# EAGLE design sidmax (EAGLE 6.6.0)

## Sheet 1 of 7: IO
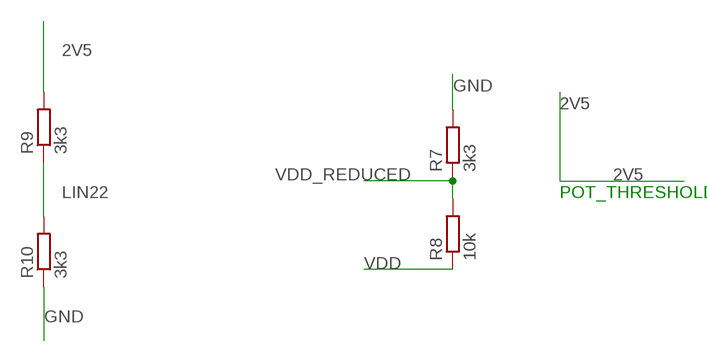
[diagram p0: schematic, sheet 1]

### Parts
R7  3k3  R-EU_R0402  [R0402]
R8  10k  R-EU_R0402  [R0402]
R9  3k3  R-EU_R0402  [R0402]
R10  3k3  R-EU_R0402  [R0402]

### Nets
2V5: R9.2 ; also sheet 2,6
GND: R7.2 R10.1 ; also sheet 2,3,4,5,6,7
LIN22: R9.1 R10.2 ; also sheet 2,3
VDD: R8.1 ; also sheet 3
VDD_REDUCED: R7.1 R8.2 ; also sheet 2

### Notes on the sheet
- POT_THRESHOLD

## Sheet 2 of 7: FPGA
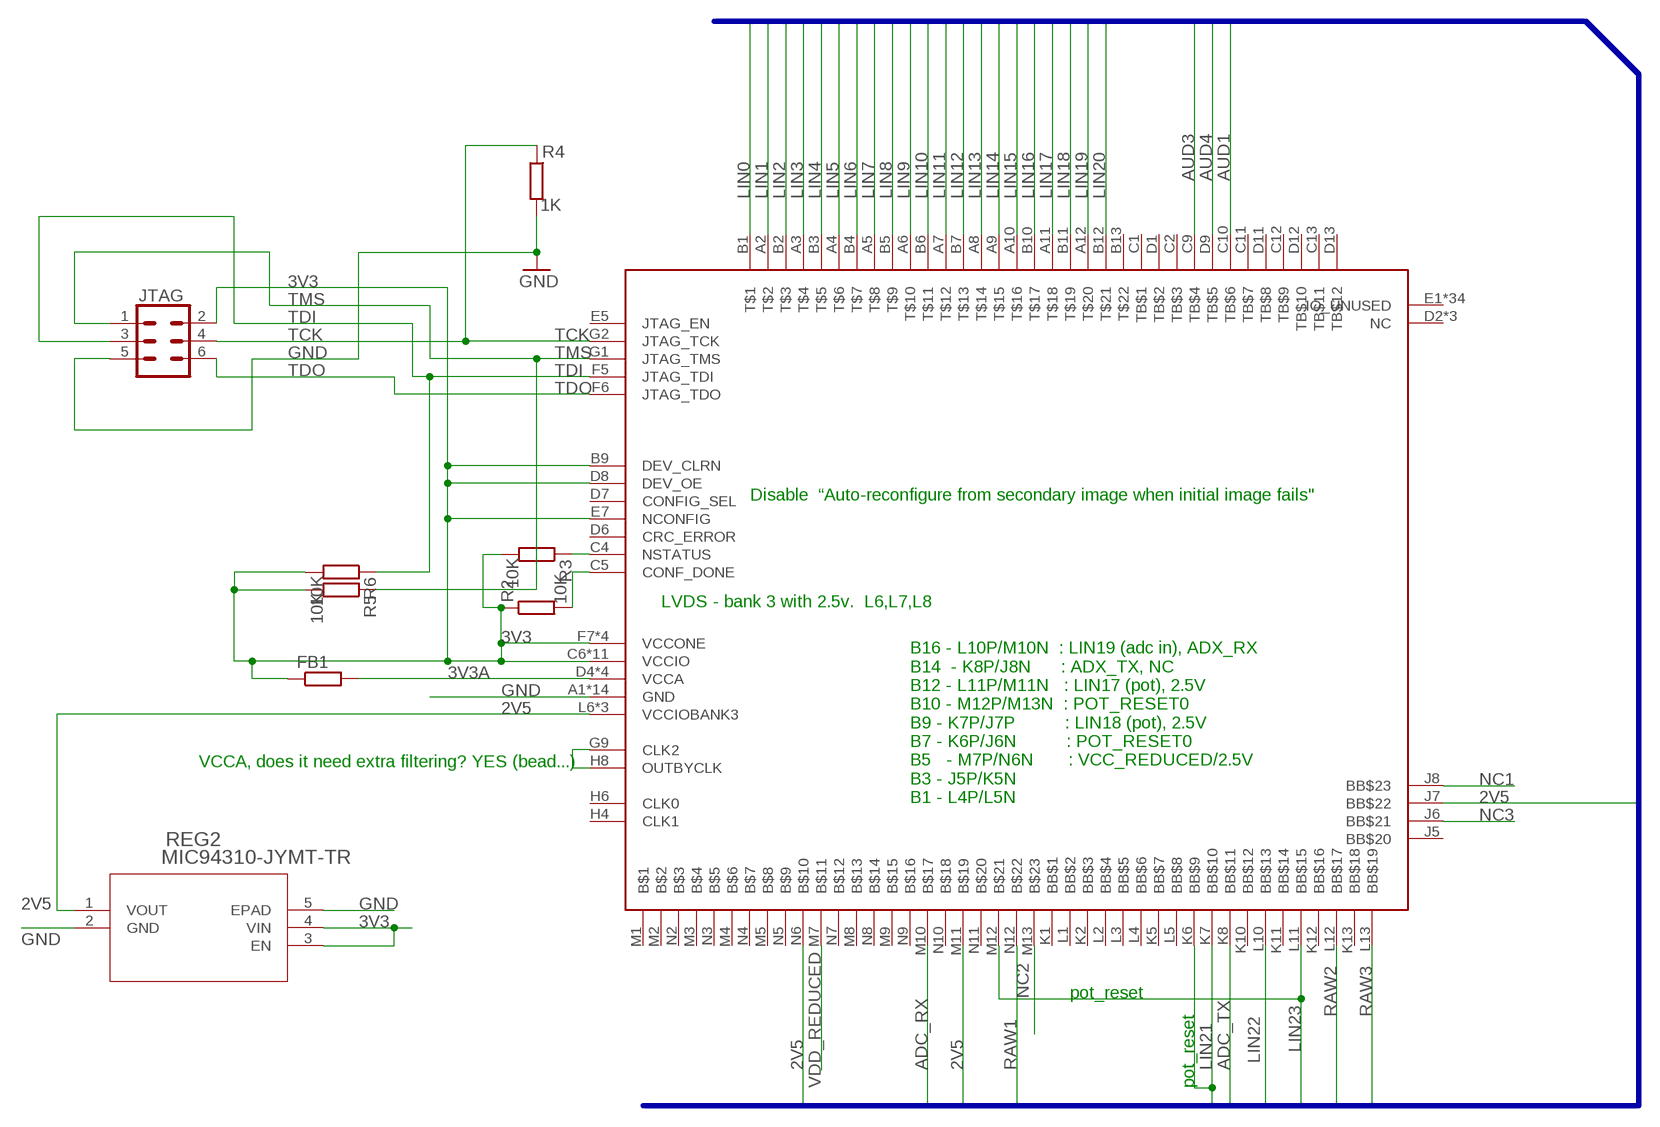
[diagram p1: schematic, sheet 2]

### Parts
FB1  R-EU_R0402  [R0402]
JTAG  CONN_03X2LOCK  [2X3_LOCK]
R2  10K  R-EU_R0402  [R0402]
R3  10K  R-EU_R0402  [R0402]
R4  1K  R-EU_R0402  [R0402]
R5  10K  R-EU_R0402  [R0402]
R6  10K  R-EU_R0402  [R0402]
REG2  MIC94310-JYMT-TR  [TDFN4_1P2X1P6_MCH]
U3  MAX10  [U169SMALL]

### Nets
2V5: REG2.1(VOUT) U3.J7(BB$22) U3.L6(VCCIOBANK3) U3.L7(VCCIOBANK3) U3.L8(VCCIOBANK3) U3.M11(B$19) U3.N6(B$10) ; also sheet 1,6
3V3: FB1.1 JTAG.2 R2.1 R3.2 R5.2 R6.2 REG2.3(EN) REG2.4(VIN) U3.B9(DEV_CLRN) U3.C6(VCCIO) U3.C7(VCCIO) U3.C8(VCCIO) U3.D8(DEV_OE) U3.E7(NCONFIG) U3.F2(VCCIO) U3.F7(VCCONE) U3.F11(VCCIO) U3.G3(VCCIO) U3.G6(VCCONE) U3.G8(VCCONE) U3.G11(VCCIO) U3.H7(VCCONE) U3.H11(VCCIO) U3.J3(VCCIO) U3.J11(VCCIO) U3.K3(VCCIO) ; also sheet 3,4,6
3V3A: FB1.2 U3.D4(VCCA) U3.D10(VCCA) U3.K4(VCCA) U3.K9(VCCA) ; also sheet 6
ADC_RX: U3.M10(B$17) ; also sheet 7
ADC_TX: U3.K8(BB$11) ; also sheet 7
AUD1: U3.C10(TB$6) ; also sheet 5
AUD3: U3.C9(TB$4) ; also sheet 5
AUD4: U3.D9(TB$5) ; also sheet 5
CONF_DONE: R2.2 U3.C5(CONF_DONE)
FAKE_CLK: U3.G9(CLK2) U3.H8(OUTBYCLK)
GND: JTAG.5 R4.2 REG2.2(GND) REG2.5(EPAD) U3.A1(GND) U3.A13(GND) U3.B8(GND) U3.C3(GND) U3.D5(GND) U3.E11(GND) U3.F3(GND) U3.G7(GND) U3.H12(GND) U3.J4(GND) U3.L9(GND) U3.M6(GND) U3.N1(GND) U3.N13(GND) ; also sheet 1,3,4,5,6,7
LIN0: U3.B1(T$1) ; also sheet 3
LIN1: U3.A2(T$2) ; also sheet 3
LIN2: U3.B2(T$3) ; also sheet 3
LIN3: U3.A3(T$4) ; also sheet 3
LIN4: U3.B3(T$5) ; also sheet 3
LIN5: U3.A4(T$6) ; also sheet 3
LIN6: U3.B4(T$7) ; also sheet 3
LIN7: U3.A5(T$8) ; also sheet 3
LIN8: U3.B5(T$9) ; also sheet 3
LIN9: U3.A6(T$10) ; also sheet 3
LIN10: U3.B6(T$11) ; also sheet 3
LIN11: U3.A7(T$12) ; also sheet 3
LIN12: U3.B7(T$13) ; also sheet 3
LIN13: U3.A8(T$14) ; also sheet 3
LIN14: U3.A9(T$15) ; also sheet 3
LIN15: U3.A10(T$16) ; also sheet 3
LIN16: U3.B10(T$17) ; also sheet 3
LIN17: U3.A11(T$18) ; also sheet 3
LIN18: U3.B11(T$19) ; also sheet 3
LIN19: U3.A12(T$20) ; also sheet 3
LIN20: U3.B12(T$21) ; also sheet 3
LIN21: U3.K6(BB$9) U3.K7(BB$10) ; also sheet 3
LIN22: U3.L10(BB$13) ; also sheet 1,3
LIN23: U3.L11(BB$15) U3.M12(B$21) ; also sheet 3
NC1: U3.J8(BB$23)
NC2: U3.M13(B$23)
NC3: U3.J6(BB$21)
NSTATUS: R3.1 U3.C4(NSTATUS)
RAW1: U3.N12(B$22) ; also sheet 3
RAW2: U3.L12(BB$17) ; also sheet 3
RAW3: U3.L13(BB$19) ; also sheet 3
TCK: JTAG.4 R4.1 U3.G2(JTAG_TCK)
TDI: JTAG.3 R6.1 U3.F5(JTAG_TDI)
TDO: JTAG.6 U3.F6(JTAG_TDO)
TMS: JTAG.1 R5.1 U3.G1(JTAG_TMS)
VDD_REDUCED: U3.M7(B$11) ; also sheet 1
Unconnected: U3.B13(T$22) U3.C1(TB$1) U3.C2(TB$3) U3.C11(TB$7) U3.C12(TB$9) U3.C13(TB$11) U3.D1(TB$2) U3.D2(NC) U3.D3(NC) U3.D6(CRC_ERROR) U3.D7(CONFIG_SEL) U3.D11(TB$8) U3.D12(TB$10) U3.D13(TB$12) U3.E1(IO_UNUSED) U3.E2(NC) U3.E3(IO_UNUSED) U3.E4(IO_UNUSED) U3.E5(JTAG_EN) U3.E6(IO_UNUSED) U3.E8(IO_UNUSED) U3.E9(IO_UNUSED) U3.E10(IO_UNUSED) U3.E12(IO_UNUSED) U3.E13(IO_UNUSED) U3.F1(IO_UNUSED) U3.F4(IO_UNUSED) U3.F8(IO_UNUSED) U3.F9(IO_UNUSED) U3.F10(IO_UNUSED) U3.F12(IO_UNUSED) U3.F13(IO_UNUSED) U3.G4(IO_UNUSED) U3.G5(IO_UNUSED) U3.G10(IO_UNUSED) U3.G12(IO_UNUSED) U3.G13(IO_UNUSED) U3.H1(IO_UNUSED) U3.H2(IO_UNUSED) U3.H3(IO_UNUSED) U3.H4(CLK1) U3.H5(IO_UNUSED) U3.H6(CLK0) U3.H9(IO_UNUSED) U3.H10(IO_UNUSED) U3.H13(IO_UNUSED) U3.J1(IO_UNUSED) U3.J2(IO_UNUSED) U3.J5(BB$20) U3.J9(IO_UNUSED) U3.J10(IO_UNUSED) U3.J12(IO_UNUSED) U3.J13(IO_UNUSED) U3.K1(BB$1) U3.K2(BB$3) U3.K5(BB$7) U3.K10(BB$12) U3.K11(BB$14) U3.K12(BB$16) U3.K13(BB$18) U3.L1(BB$2) U3.L2(BB$4) U3.L3(BB$5) U3.L4(BB$6) U3.L5(BB$8) U3.M1(B$1) U3.M2(B$2) U3.M3(B$4) U3.M4(B$6) U3.M5(B$8) U3.M8(B$13) U3.M9(B$15) U3.N2(B$3) U3.N3(B$5) U3.N4(B$7) U3.N5(B$9) U3.N7(B$12) U3.N8(B$14) U3.N9(B$16) U3.N10(B$18) U3.N11(B$20)

### Buses
LIN[0..23],AUD[1..4],2V5,ADC_RX,ADC_TX,RAW[1..3]

### Notes on the sheet
- Disable  “Auto-reconfigure from secondary image when initial image fails"
- LVDS - bank 3 with 2.5v.  L6,L7,L8
- VCCA, does it need extra filtering? YES (bead...)
- B16 - L10P/M10N  : LIN19 (adc in), ADX_RX
  B14  - K8P/J8N      : ADX_TX, NC
  B12 - L11P/M11N   : LIN17 (pot), 2.5V
  B10 - M12P/M13N  : POT_RESET0
  B9 - K7P/J7P          : LIN18 (pot), 2.5V
  B7 - K6P/J6N          : POT_RESET0
  B5   - M7P/N6N       : VCC_REDUCED/2.5V
  B3 - J5P/K5N
  B1 - L4P/L5N
- pot_reset
- pot_reset

## Sheet 3 of 7: Level conv
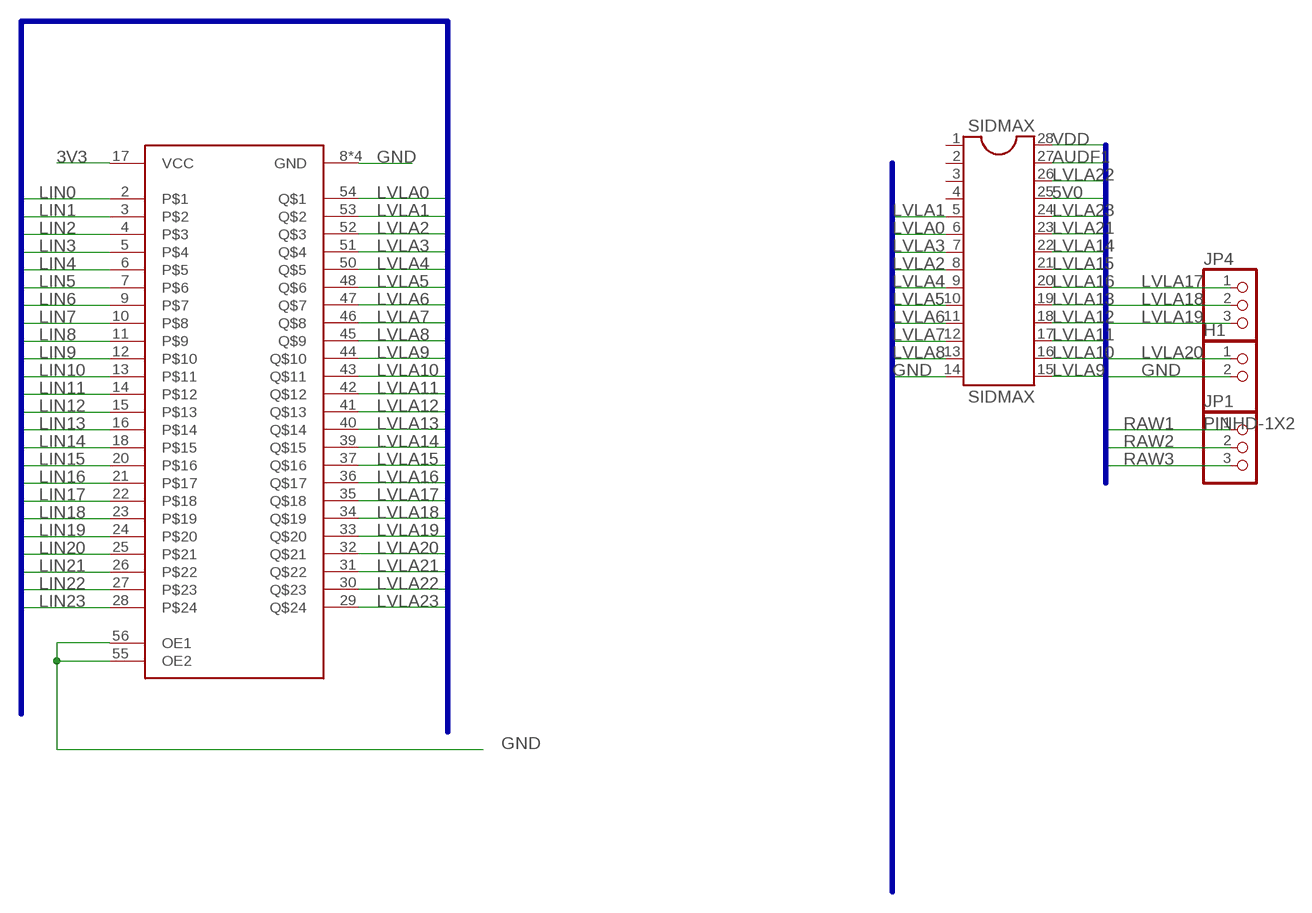
[diagram p2: schematic, sheet 3]

### Parts
H1  PINHD-1X2  [1X02]
JP1  PINHD-1X3  [1X03]
JP4  PINHD-1X3  [1X03]
SIDMAX  SIDMAX  DIL28  [DIL28-6]
U2  SN74CB3T16211SM  [56TVSOP_SMALL]

### Nets
3V3: U2.17(VCC) ; also sheet 2,4,6
5V0: SIDMAX.25 ; also sheet 4,5,6
AUDF1: SIDMAX.27 ; also sheet 5
GND: H1.2 SIDMAX.14 U2.8(GND) U2.19(GND) U2.38(GND) U2.49(GND) U2.55(OE2) U2.56(OE1) ; also sheet 1,2,4,5,6,7
LIN0: U2.2 ; also sheet 2
LIN1: U2.3 ; also sheet 2
LIN2: U2.4 ; also sheet 2
LIN3: U2.5 ; also sheet 2
LIN4: U2.6 ; also sheet 2
LIN5: U2.7 ; also sheet 2
LIN6: U2.9 ; also sheet 2
LIN7: U2.10 ; also sheet 2
LIN8: U2.11 ; also sheet 2
LIN9: U2.12 ; also sheet 2
LIN10: U2.13 ; also sheet 2
LIN11: U2.14 ; also sheet 2
LIN12: U2.15 ; also sheet 2
LIN13: U2.16 ; also sheet 2
LIN14: U2.18 ; also sheet 2
LIN15: U2.20 ; also sheet 2
LIN16: U2.21 ; also sheet 2
LIN17: U2.22 ; also sheet 2
LIN18: U2.23 ; also sheet 2
LIN19: U2.24 ; also sheet 2
LIN20: U2.25 ; also sheet 2
LIN21: U2.26 ; also sheet 2
LIN22: U2.27 ; also sheet 1,2
LIN23: U2.28 ; also sheet 2
LVLA0: SIDMAX.6 U2.54(Q$1)
LVLA1: SIDMAX.5 U2.53(Q$2)
LVLA2: SIDMAX.8 U2.52(Q$3)
LVLA3: SIDMAX.7 U2.51(Q$4)
LVLA4: SIDMAX.9 U2.50(Q$5)
LVLA5: SIDMAX.10 U2.48(Q$6)
LVLA6: SIDMAX.11 U2.47(Q$7)
LVLA7: SIDMAX.12 U2.46(Q$8)
LVLA8: SIDMAX.13 U2.45(Q$9)
LVLA9: SIDMAX.15 U2.44(Q$10)
LVLA10: SIDMAX.16 U2.43(Q$11)
LVLA11: SIDMAX.17 U2.42(Q$12)
LVLA12: SIDMAX.18 U2.41(Q$13)
LVLA13: SIDMAX.19 U2.40(Q$14)
LVLA14: SIDMAX.22 U2.39(Q$15)
LVLA15: SIDMAX.21 U2.37(Q$16)
LVLA16: SIDMAX.20 U2.36(Q$17)
LVLA17: JP4.1 U2.35(Q$18)
LVLA18: JP4.2 U2.34(Q$19)
LVLA19: JP4.3 U2.33(Q$20)
LVLA20: H1.1 U2.32(Q$21)
LVLA21: SIDMAX.23 U2.31(Q$22)
LVLA22: SIDMAX.26 U2.30(Q$23)
LVLA23: SIDMAX.24 U2.29(Q$24)
RAW1: JP1.1 ; also sheet 2
RAW2: JP1.2 ; also sheet 2
RAW3: JP1.3 ; also sheet 2
VDD: SIDMAX.28 ; also sheet 1
Unconnected: SIDMAX.1 SIDMAX.2 SIDMAX.3 SIDMAX.4

### Buses
LVLA[0..23],VDD,3V3,GND,5V0,AUDF1,RAW[1..3]
LIN[0..23],LVLA[0..23]
LVLA[0..23],GND

## Sheet 4 of 7: Power regs
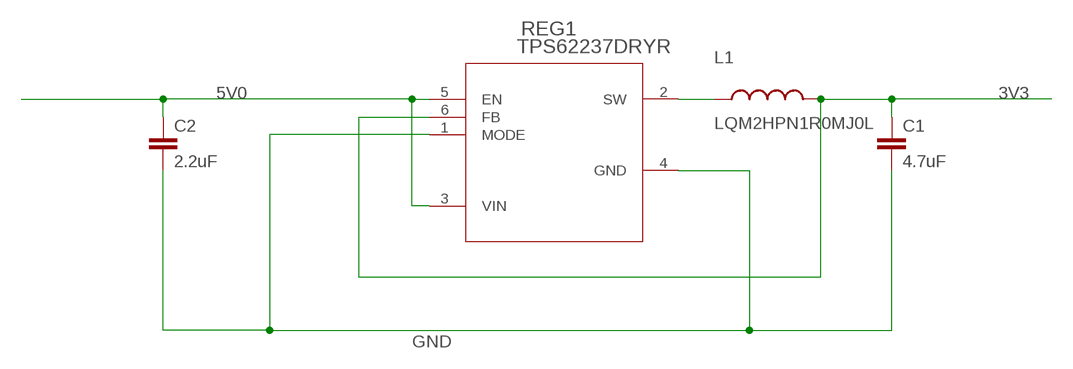
[diagram p3: schematic, sheet 4]

### Parts
C1  4.7uF  C-EUC0402  [C0402]
C2  2.2uF  C-EUC0402  [C0402]
L1  LQM2HPN1R0MJ0L  [INDC1008X04]
REG1  TPS62237DRYR  [DRY6]

### Nets
3V3: C1.1 L1.2 REG1.6(FB) ; also sheet 2,3,6
5V0: C2.1 REG1.3(VIN) REG1.5(EN) ; also sheet 3,5,6
GND: C1.2 C2.2 REG1.1(MODE) REG1.4(GND) ; also sheet 1,2,3,5,6,7
N$137: L1.1 REG1.2(SW)

## Sheet 5 of 7: Audio filter
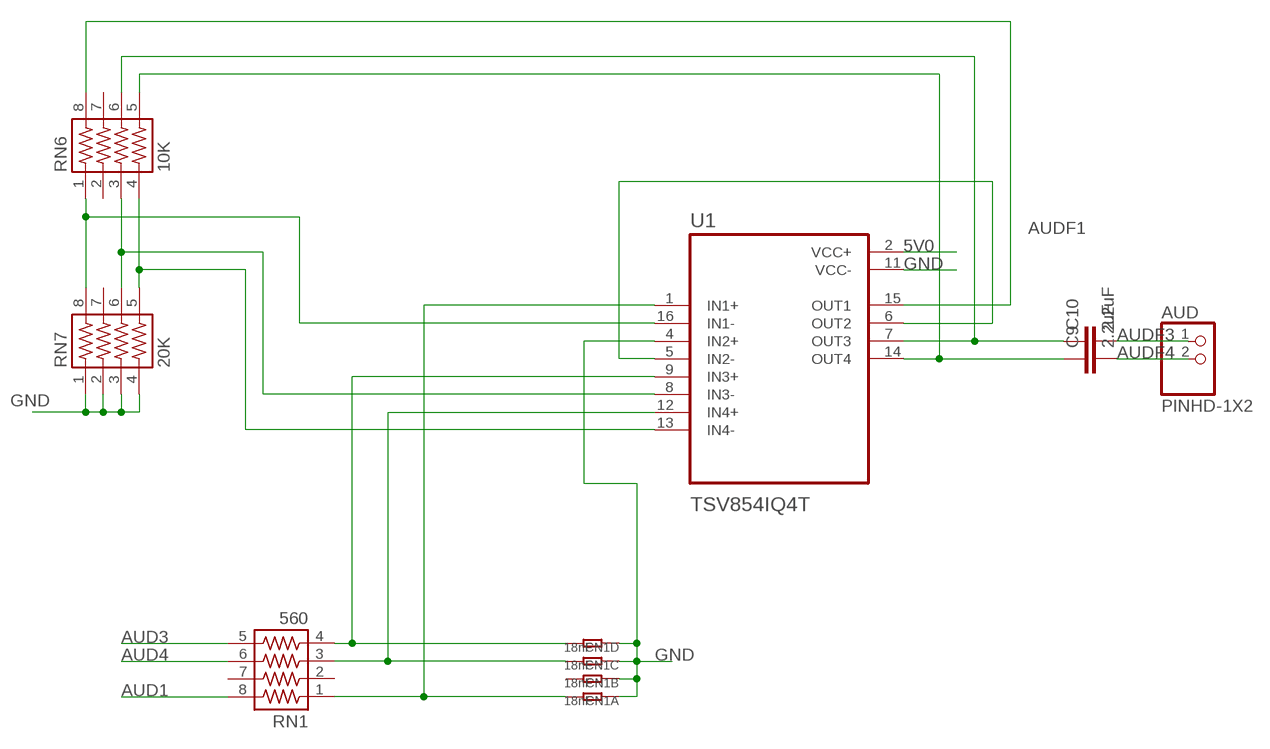
[diagram p4: schematic, sheet 5]

### Parts
AUD  PINHD-1X2  [1X02]
C9  2.2uF  C-EUC0402  [C0402]
C10  2.2uF  C-EUC0402  [C0402]
CN1  18nF  R-4R  [R1206-8]
RN1  560  741-8  [741-8]
RN6  10K  741-8  [741-8]
RN7  20K  741-8  [741-8]
U1  TSV854IQ4T  [QFN50P300X300X100-16N]

### Nets
5V0: U1.2(VCC+) ; also sheet 3,4,6
AMPIN1M: RN6.1 RN7.8 U1.16(IN1-)
AMPIN1P: CN1.8 RN1.1 U1.1(IN1+)
AMPIN3M: RN6.3 RN7.6 U1.8(IN3-)
AMPIN3P: CN1.5 RN1.4 U1.9(IN3+)
AMPIN4P: CN1.6 RN1.3 U1.12(IN4+)
AUD1: RN1.8 ; also sheet 2
AUD3: RN1.5 ; also sheet 2
AUD4: RN1.6 ; also sheet 2
AUDF1: RN6.8 U1.15(OUT1) ; also sheet 3
AUDF2: U1.5(IN2-) U1.6(OUT2)
AUDF3: AUD.1 C10.2
AUDF4: AUD.2 C9.2
GND: CN1.1 CN1.2 CN1.3 CN1.4 RN7.1 RN7.2 RN7.3 RN7.4 U1.4(IN2+) U1.11(VCC-) ; also sheet 1,2,3,4,6,7
N$5: C9.1 RN6.5 U1.14(OUT4)
N$7: C10.1 RN6.6 U1.7(OUT3)
N$22: RN6.4 RN7.5 U1.13(IN4-)
Unconnected: CN1.7 RN1.2 RN1.7 RN6.2 RN6.7 RN7.7

## Sheet 6 of 7: Decoupling
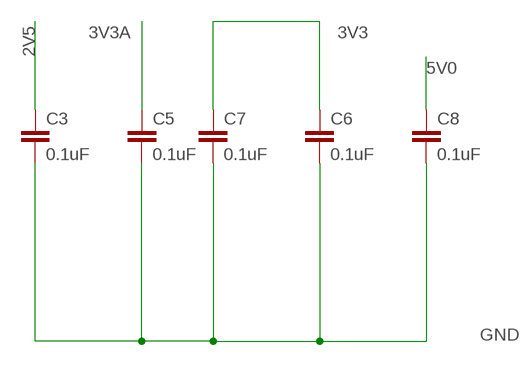
[diagram p5: schematic, sheet 6]

### Parts
C3  0.1uF  C-EUC0402  [C0402]
C5  0.1uF  C-EUC0402  [C0402]
C6  0.1uF  C-EUC0402  [C0402]
C7  0.1uF  C-EUC0402  [C0402]
C8  0.1uF  C-EUC0402  [C0402]

### Nets
2V5: C3.1 ; also sheet 1,2
3V3: C6.1 C7.1 ; also sheet 2,3,4
3V3A: C5.1 ; also sheet 2
5V0: C8.1 ; also sheet 3,4,5
GND: C3.2 C5.2 C6.2 C7.2 C8.2 ; also sheet 1,2,3,4,5,7

## Sheet 7 of 7: ADC
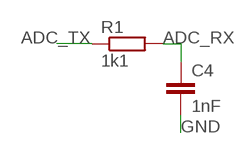
[diagram p6: schematic, sheet 7]

### Parts
C4  1nF  C-EUC0402  [C0402]
R1  1k1  R-EU_R0402  [R0402]

### Nets
ADC_RX: C4.1 R1.2 ; also sheet 2
ADC_TX: R1.1 ; also sheet 2
GND: C4.2 ; also sheet 1,2,3,4,5,6

## Library data of the parts
AUD H1 = max10:PINHD-1X2
C1-C10 = rcl:C-EU: CAPACITOR, European symbol
CN1 = Discrete:R-4R*: Resistor Array
FB1 R1-R10 = rcl:R-EU_: RESISTOR, European symbol
JP1 JP4 = max10:PINHD-1X3: PIN HEADER
JTAG = SparkFun-Connectors:CONN_03X2: Multi connection point. Often used as Generic Header-pin footprint for 0.1 inch spaced/style header connections You can populate with any combo of single row headers, but if you'd like an exact match, check these: Header - 2x3 (Male, 0.1") <https://www.sparkfun.com/products/12807> (PRT-12807) Header - 2x3 (Female, 0.1") <https://www.sparkfun.com/products/13010> (PRT-13010) 2x3 Pin Shrouded Header <https://www.sparkfun.com/products/10877> (PRT-10877) On any of the 0.1 inch spaced packages, you can populate with these: Break Away Headers - Straight <https://www.sparkfun.com/products/116> (PRT-00116) Break Away Male Headers - Right Angle <https://www.sparkfun.com/products/553> (PRT-00553) Female Headers <https://www.sparkfun.com/products/115> (PRT-00115) Break Away Headers - Machine Pin <https://www.sparkfun.com/products/117> (PRT-00117) Break Away Female Headers - Swiss Machine Pin <https://www.sparkfun.com/products/743> (PRT-00743) Special note: the shrouded connector mates well with our 3x2 ribbon cables: Ribbon Crimp Connector - 6-pin (2x3, Female) <https://www.sparkfun.com/products/10651> (PRT-10651) Ribbon Cable - 6 wire (15ft) <https://www.sparkfun.com/products/10646> (PRT-10646)
L1 = LQM2HPN1R0MJ0L:LQM2HPN1R0MJ0L: Inductor Power Chip Shielded Multi-Layer 1uH 20% 1MHz Ferrite 1.5A 113mOhm DCR 1008 Embossed T/R; DESCRIPTION: Inductor Power Chip Shielded Multi-Layer 1uH 20% 1MHz Ferrite 1.5A 113mOhm DCR 1008 Embossed T/R; DIGI-KEY_PART_NUMBER: 490-6699-1-ND; DIGI-KEY_PURCHASE_URL: https://www.digikey.com/product-detail/en/murata-electronics-north-america/LQM2HPN1R0MJ0L/490-6699-1-ND/3845896?utm_source=snapeda&utm_medium=aggregator&utm_campaign=symbol; MF: Murata Electronics; MP: LQM2HPN1R0MJ0L; PACKAGE: 1008 Murata
REG1 = max10:TPS62237DRYR; MANUFACTURER_PART_NUMBER: TPS62237DRYR; VENDOR: Texas Instruments
REG2 = max10:MIC94310-JYMT-TR; BUILT_BY: EMA_Jessica; COPYRIGHT: Copyright (C) 2018 Accelerated Designs. All rights reserved; MANUFACTURER_PART_NUMBER: MIC94310-JYMT-TR; SOURCELIBRARY: Microchip_2019-08-23_18; VENDOR: Microchip
RN1 RN6 RN7 = resistor-array:741-8: CTS 741 Series 8 Terminations, 4 Resistors
SIDMAX = ic-package:DIL28: Dual In Line
U1 = TSV854IQ4T:TSV854IQ4T: None; AVAILABILITY: Unavailable; DESCRIPTION: General Purpose Amplifier 4 Circuit Rail-to-Rail 16-QFN _3x3_; MF: STMicroelectronics; MP: TSV854IQ4T; PACKAGE: QFN-16 STMicroelectronics; PRICE: None
U2 = max10:SN74CB3T16211
U3 = max10:MAX10

## Board
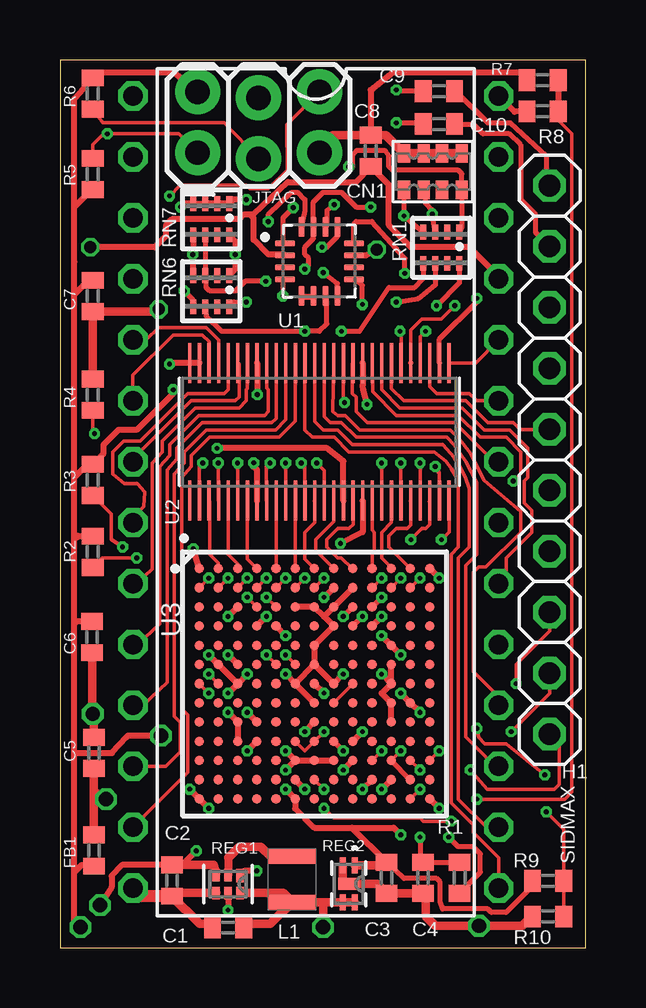
[diagram p7: board, top side]
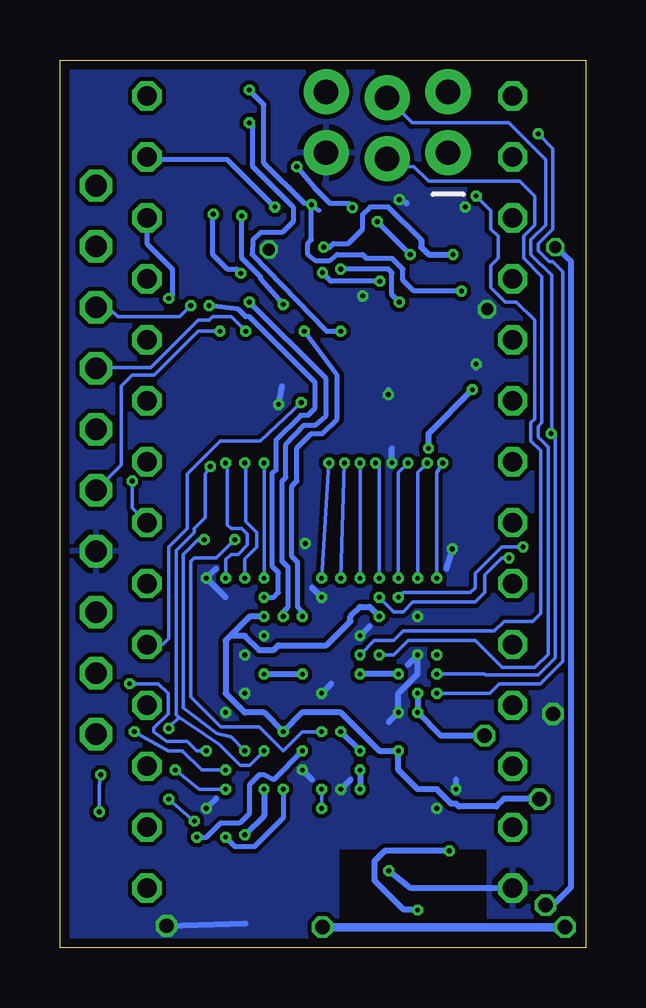
[diagram p8: board, bottom side, seen from below]

Size 21.9 x 37 mm. Coordinates in mm from the lower left corner, seen from the top.
Outline: 21.9,37 0,37 0,0 21.9,0 21.9,37
Copper layers (1*2*15*16): Top 0.035559375mm / dielectric 1.6mm / Route2 0.0356mm / dielectric 0.1499mm / Route15 0.0356mm / dielectric 0.2007mm / Bottom 0.035559375mm
Design rules "oshpark-2layer_5mil *": minimum track width 6mil, minimum drill 0.2mm, track to track 5mil, track to pad 5mil, pad to pad 5mil, via to via 5mil, smd to smd 5mil, copper to edge 15mil, drill to drill 6mil, minimum pad ring 5mil, minimum via ring 5mil, stop-mask expansion 2.5mil, vias tented up to drill 20mil, thermal gap 10mil

### Footprints (pad centres in the part's own frame; a part is rotated, then mirrored left to right if it is on the bottom)
1X02 = drill 0.9 octagon: 1 0,0; 2 2.54,0
C0402 = smd 0.7 x 0.9: 1 -0.65,0; 2 0.65,0
R1206-8 = smd 0.508 x 0.762: 1 -1.206,-0.762; 2 -0.381,-0.762; 3 0.381,-0.762; 4 1.206,-0.762; 5 1.206,0.762; 6 0.381,0.762; 7 -0.381,0.762; 8 -1.206,0.762
R0402 = smd 0.7 x 0.9: 1 -0.65,0; 2 0.65,0
1X03 = drill 0.9 octagon: 1 -2.54,0; 2 0,0; 3 2.54,0
2X3_LOCK = drill 1.016 pad 1.88: 1 0,0.127; 2 0,2.667; 3 2.54,-0.127; 4 2.54,2.413; 5 5.08,0.127; 6 5.08,2.667
INDC1008X04 = smd 0.6 x 2: 1 -0.95,0; 2 0.95,0
DRY6 = smd 0.55 x 0.3: 1 -0.355,0.5 | smd 0.52 x 0.3: 2 -0.37,0; 3 -0.37,-0.5; 4 0.37,-0.5; 5 0.37,0; 6 0.37,0.5
TDFN4_1P2X1P6_MCH = smd 0.66 x 0.254: 1 -0.775,0.254; 2 -0.775,-0.254; 3 0.775,-0.254; 4 0.775,0.254 | smd 0.508 x 0.864: 5 0,0
741-8 = smd 0.25 x 0.61: 1 -0.75,-0.65; 2 -0.25,-0.65; 3 0.25,-0.65; 4 0.75,-0.65; 5 0.75,0.65; 6 0.25,0.65; 7 -0.25,0.65; 8 -0.75,0.65
DIL28-6 = drill 0.813 octagon: 1 -16.51,-7.62; 2 -13.97,-7.62; 3 -11.43,-7.62; 4 -8.89,-7.62; 5 -6.35,-7.62; 6 -3.81,-7.62; 7 -1.27,-7.62; 8 1.27,-7.62; 9 3.81,-7.62; 10 6.35,-7.62; 11 8.89,-7.62; 12 11.43,-7.62; 13 13.97,-7.62; 14 16.51,-7.62; 15 16.51,7.62; 16 13.97,7.62; 17 11.43,7.62; 18 8.89,7.62; 19 6.35,7.62; 20 3.81,7.62; 21 1.27,7.62; 22 -1.27,7.62; 23 -3.81,7.62; 24 -6.35,7.62; 25 -8.89,7.62; 26 -11.43,7.62; 27 -13.97,7.62; 28 -16.51,7.62
QFN50P300X300X100-16N = smd 0.84 x 0.26: 1 -1.435,0.75; 2 -1.435,0.25; 3 -1.435,-0.25; 4 -1.435,-0.75; 9 1.435,-0.75; 10 1.435,-0.25; 11 1.435,0.25; 12 1.435,0.75 | smd 0.26 x 0.84: 5 -0.75,-1.435; 6 -0.25,-1.435; 7 0.25,-1.435; 8 0.75,-1.435; 13 0.75,1.435; 14 0.25,1.435; 15 -0.25,1.435; 16 -0.75,1.435
56TVSOP_SMALL = smd 1.676 x 0.178: 1 -2.87,5.4; 2 -2.87,5; 3 -2.87,4.6; 4 -2.87,4.2; 5 -2.87,3.8; 6 -2.87,3.4; 7 -2.87,3; 8 -2.87,2.6; 9 -2.87,2.2; 10 -2.87,1.8; 11 -2.87,1.4; 12 -2.87,1; 13 -2.87,0.6; 14 -2.87,0.2; 15 -2.87,-0.2; 16 -2.87,-0.6; 17 -2.87,-1; 18 -2.87,-1.4; 19 -2.87,-1.8; 20 -2.87,-2.2; 21 -2.87,-2.6; 22 -2.87,-3; 23 -2.87,-3.4; 24 -2.87,-3.8; 25 -2.87,-4.2; 26 -2.87,-4.6; 27 -2.87,-5; 28 -2.87,-5.4; 29 2.87,-5.4; 30 2.87,-5; 31 2.87,-4.6; 32 2.87,-4.2; 33 2.87,-3.8; 34 2.87,-3.4; 35 2.87,-3; 36 2.87,-2.6; 37 2.87,-2.2; 38 2.87,-1.8; 39 2.87,-1.4; 40 2.87,-1; 41 2.87,-0.6; 42 2.87,-0.2; 43 2.87,0.2; 44 2.87,0.6; 45 2.87,1; 46 2.87,1.4; 47 2.87,1.8; 48 2.87,2.2; 49 2.87,2.6; 50 2.87,3; 51 2.87,3.4; 52 2.87,3.8; 53 2.87,4.2; 54 2.87,4.6; 55 2.87,5; 56 2.87,5.4
U169SMALL = smd 0.4 x 0.4: A1 -4.8,4.8; A2 -4,4.8; A3 -3.2,4.8; A4 -2.4,4.8; A5 -1.6,4.8; A6 -0.8,4.8; A7 0,4.8; A8 0.8,4.8; A9 1.6,4.8; A10 2.4,4.8; A11 3.2,4.8; A12 4,4.8; A13 4.8,4.8; B1 -4.8,4; B2 -4,4; B3 -3.2,4; B4 -2.4,4; B5 -1.6,4; B6 -0.8,4; B7 0,4; B8 0.8,4; B9 1.6,4; B10 2.4,4; B11 3.2,4; B12 4,4; B13 4.8,4; C1 -4.8,3.2; C2 -4,3.2; C3 -3.2,3.2; C4 -2.4,3.2; C5 -1.6,3.2; C6 -0.8,3.2; C7 0,3.2; C8 0.8,3.2; C9 1.6,3.2; C10 2.4,3.2; C11 3.2,3.2; C12 4,3.2; C13 4.8,3.2; D1 -4.8,2.4; D2 -4,2.4; D3 -3.2,2.4; D4 -2.4,2.4; D5 -1.6,2.4; D6 -0.8,2.4; D7 0,2.4; D8 0.8,2.4; D9 1.6,2.4; D10 2.4,2.4; D11 3.2,2.4; D12 4,2.4; D13 4.8,2.4; E1 -4.8,1.6; E2 -4,1.6; E3 -3.2,1.6; E4 -2.4,1.6; E5 -1.6,1.6; E6 -0.8,1.6; E7 0,1.6; E8 0.8,1.6; E9 1.6,1.6; E10 2.4,1.6; E11 3.2,1.6; E12 4,1.6; E13 4.8,1.6; F1 -4.8,0.8; F2 -4,0.8; F3 -3.2,0.8; F4 -2.4,0.8; F5 -1.6,0.8; F6 -0.8,0.8; F7 0,0.8; F8 0.8,0.8; F9 1.6,0.8; F10 2.4,0.8; F11 3.2,0.8; F12 4,0.8; F13 4.8,0.8; G1 -4.8,0; G2 -4,0; G3 -3.2,0; G4 -2.4,0; G5 -1.6,0; G6 -0.8,0; G7 0,0; G8 0.8,0; G9 1.6,0; G10 2.4,0; G11 3.2,0; G12 4,0; G13 4.8,0; H1 -4.8,-0.8; H2 -4,-0.8; H3 -3.2,-0.8; H4 -2.4,-0.8; H5 -1.6,-0.8; H6 -0.8,-0.8; H7 0,-0.8; H8 0.8,-0.8; H9 1.6,-0.8; H10 2.4,-0.8; H11 3.2,-0.8; H12 4,-0.8; H13 4.8,-0.8; J1 -4.8,-1.6; J2 -4,-1.6; J3 -3.2,-1.6; J4 -2.4,-1.6; J5 -1.6,-1.6; J6 -0.8,-1.6; J7 0,-1.6; J8 0.8,-1.6; J9 1.6,-1.6; J10 2.4,-1.6; J11 3.2,-1.6; J12 4,-1.6; J13 4.8,-1.6; K1 -4.8,-2.4; K2 -4,-2.4; K3 -3.2,-2.4; K4 -2.4,-2.4; K5 -1.6,-2.4; K6 -0.8,-2.4; K7 0,-2.4; K8 0.8,-2.4; K9 1.6,-2.4; K10 2.4,-2.4; K11 3.2,-2.4; K12 4,-2.4; K13 4.8,-2.4; L1 -4.8,-3.2; L2 -4,-3.2; L3 -3.2,-3.2; L4 -2.4,-3.2; L5 -1.6,-3.2; L6 -0.8,-3.2; L7 0,-3.2; L8 0.8,-3.2; L9 1.6,-3.2; L10 2.4,-3.2; L11 3.2,-3.2; L12 4,-3.2; L13 4.8,-3.2; M1 -4.8,-4; M2 -4,-4; M3 -3.2,-4; M4 -2.4,-4; M5 -1.6,-4; M6 -0.8,-4; M7 0,-4; M8 0.8,-4; M9 1.6,-4; M10 2.4,-4; M11 3.2,-4; M12 4,-4; M13 4.8,-4; N1 -4.8,-4.8; N2 -4,-4.8; N3 -3.2,-4.8; N4 -2.4,-4.8; N5 -1.6,-4.8; N6 -0.8,-4.8; N7 0,-4.8; N8 0.8,-4.8; N9 1.6,-4.8; N10 2.4,-4.8; N11 3.2,-4.8; N12 4,-4.8; N13 4.8,-4.8

### Placement (x,y rotation side)
AUD  20.4,29.22 90 top
C1  7,0.84 180 top
C2  4.67,2.79 270 top
C3  13.61,2.91 270 top
C4  15.13,2.91 270 top
C5  1.41,8.11 90 top
C6  1.34,12.94 270 top
C7  1.36,27.16 270 top
C8  12.95,33.21 90 top
C9  15.79,35.7 0 top
C10  15.79,34.33 0 top
CN1  15.54,32.34 180 top
FB1  1.41,4.05 90 top
H1  20.4,19.06 270 top
JP1  20.4,11.44 90 top
JP4  20.4,24.14 90 top
JTAG  5.73,33.01 0 top
L1  9.67,2.84 270 top
R1  16.65,2.91 90 top
R2  1.36,16.5 270 top
R3  1.36,19.49 90 top
R4  1.36,23.04 90 top
R5  1.36,32.24 270 top
R6  1.36,35.6 90 top
R7  20.11,36.16 180 top
R8  20.11,34.86 0 top
R9  20.34,2.78 180 top
R10  20.34,1.3 0 top
REG1  7,2.64 270 top
REG2  12.03,2.65 270 top
RN1  15.89,29.17 180 top
RN6  6.3,27.36 180 top
RN7  6.3,30.36 180 top
SIDMAX  10.66,18.99 270 top
U1  10.81,28.61 0 top
U2  10.81,21.5 90 top
U3  10.6,11 0 top

### Tracks (layer width: path | path; a pad name or v marks a point on that pad's centre or on a via)
2V5  (via drill 0.2)
  Top 0.203: C3.1 14.33,2.88 15.69,2.88 15.84,2.73 15.84,1.92 15.95,1.61 17.82,1.61 17.98,1.46 18.58,1.46 19.69,2.56 R9.2
  Top 0.254: 13.48,3.43 C3.1 12.16,5 | U3.L8 U3.L7 U3.L6 | U3.L6 v9.4,7.4 | v9.4,6.6 U3.N6 9.8,5.8 10.6,5 12.16,5 | U3.J7 v10.2,9 | v9.4,8.2 U3.L6 | U3.M11 v13.4,6.6 | 12.16,5 13.9,5 v14.2,4.7
  Top 0.356: REG2.1 13.48,3.43
  Bottom 0.254: v9.4,7.4 v9.4,6.6 | v10.2,9 v9.4,8.2 | v13.4,6.6 13.4,5.5 v14.2,4.7
3V3  (via drill 0.2, 0.6)
  Top 0.203: 0.6,28.81 0.6,28.59
  Top 0.254: U3.J11 U3.H11 13.4,10.6 U3.G11 | U3.G11 U3.F11 | U3.C6 U3.C7 11,13.8 | U3.B9 U3.C8 11,13.8 | U3.F7 U3.G8 v11.8,11.4 | U3.F7 U3.E7 U3.D8 11,13.8 | U3.F7 U3.G6 | U3.H7 U3.G6 | U3.K3 U3.J3 v7,9.8 | 7.5,0.99 C1.1 | 11.76,1.89 REG2.3 | 10.96,1.74 10.81,1.89 | 0.6,3.14 0.6,1.1 v0.86,0.85 | 0.6,3.14 0.91,3.44 1.37,3.44 FB1.1 | 0.6,3.14 0.6,8.11 | 0.6,8.11 0.6,13.5 | 0.6,13.5 0.6,17 | 0.6,17 0.75,17.16 R2.1 | 0.6,17 0.6,19.59 | 0.6,19.59 0.6,27.22 | 0.6,27.22 0.6,28.59 0.6,30.87 | C7.1 1.2,27.81 0.6,27.22 | JTAG.2 4.74,36.49 1.76,36.49 R6.2 0.6,35.39 0.6,30.87 | U2.17 11.81,20.27 11.12,20.81 v6.54,20.81 | R3.2 1.23,20.22 0.6,19.59 | v6.2,12.2 U3.F2 U3.G3 | U3.G6 v9.4,11.4 | U3.G11 v13.4,11.4 | U3.G3 v7.8,11.4 | U3.G3 v7,10.6 | R5.2 1.32,31.59 0.6,30.87 | R3.2 1.5,20.22 | 0.6,8.11 2.16,8.11 2.76,8.76 2.82,8.82 v4.21,8.82 | C6.1 0.69,13.59 0.6,13.5 | U3.G11 | v4.72,23.25 4.72,23.1 3.19,21.58 2.43,21.58 1.82,20.97 1.82,20.6 R3.2
  Top 0.356: REG1.6 9.29,2.27 L1.2 | L1.2 10.81,1.89 11.76,1.89 | REG2.3 REG2.4 | 7.5,0.99 8.76,0.99 L1.2 | v10.96,0.85 10.96,1.74
  Bottom 0.254: v7,10.6 v7,9.8 6.03,8.82 v4.21,8.82 | v13.4,11.4 v11.8,11.4 | v7.8,11.4 v9.4,11.4 | v6.54,20.81 6.54,21.42 v4.72,23.25
  Bottom 0.356: v10.96,0.85 v0.86,0.85
3V3A  (via drill 0.2, 0.6)
  Top 0.254: C5.1 1.41,6.59 v1.92,6.18 | v7.8,8.2 U3.K4 | v12.6,9 U3.K9 | v8.6,13.8 U3.D4 | U3.D10 v13.4,13.8
  Top 0.356: FB1.2 C5.1
  Bottom 0.254: v1.92,6.18 2.25,6.2 3.4,6.2 3.72,5.88 5.28,5.88 5.4,6 5.6,6 6.2,6.6 7,6.6 7.8,7.4 v7.8,8.2 8.6,8.2 10.2,9.8 11.8,9.8 v12.6,9 13.4,9.8 14.2,9.8 15,10.6 15,12.8 14.8,13 | v8.6,13.8 9,14.2 9.4,14.2 9.8,13.8 9.8,13.6 10.8,12.6 12.8,12.6 13,12.4 13.6,12.4 14.2,13 14.8,13 | v13.4,13.8 14,13.8 14.8,13
5V0  (via drill 0.2, 0.5, 0.6)
  Top 0.254: REG1.5 7,1.46 v7,1.56 | v1.67,1.76 2.15,2.53 2.15,2.98 2.59,3.44 C2.1 5.09,3.44 v5.68,4.03 | 7.92,30.57 7.66,30.57 7.46,30.36 4.66,30.36 4.41,30.11 4.41,29.65 3.95,29.2 v1.26,29.2 | 7.92,30.57 8.07,30.57 9.49,31.91 12.33,31.91 C8.1 13.71,31.8 13.71,30.11 14.62,29.2 17.06,29.2 18.28,27.98 SIDMAX.25 | U1.2 9.34,28.89 8.68,28.89 8.07,29.5 8.07,30.41 7.92,30.57
  Top 0.34: 6.4,3.44 REG1.3
  Top 0.356: C2.1 6.4,3.44
  Bottom 0.254: v1.26,29.2 0.6,28.59 0.6,2.53 1.36,1.76 v1.67,1.76 | v5.68,4.03 8.37,4.03 8.8,3.6 8.8,2.8 7.6,1.6 7.04,1.6 v7,1.56
ADC_RX  (via drill 0.2)
  Top 0.203: U3.M10 v12.6,6.6 | v15,4.6 15,3.69 C4.1 R1.2
  Bottom 0.203: v12.6,6.6 12.6,5.4 13.8,4.2 14.6,4.2 v15,4.6
ADC_TX  (via drill 0.2)
  Top 0.203: U3.K8 v11.8,8.2 | v16.2,4.6 16.6,4.2 17.21,4.2 17.52,3.9 17.52,3.14 16.65,2.27 R1.1
  Bottom 0.203: v11.8,8.2 13,7 13.4,7.2 13.6,7.2 14,6.8 14,5.6 14.4,5.2 15.2,5.2 15.8,4.6 v16.2,4.6
AMPIN1M  (via drill 0.2)
  Top 0.203: RN6.1 7.31,28.26 v7.31,28.89 7.31,29.46 RN7.8 | v8.68,30.26 8.68,30.57 9.64,31.48 9.9,31.48 10.2,31.18 10.2,30.72 U1.16
  Bottom 0.203: v7.31,28.89 v8.68,30.26
AMPIN1P  (via drill 0.2)
  Top 0.203: RN1.1 16.74,30.05 CN1.8 16.74,32.26 16.6,32.4 13.86,32.4 13.71,32.55 13.71,33.01 13.55,33.21 12.34,33.21 12.18,33.01 12.18,32.55 v12.03,32.55 | v9.72,30.85 9.29,30.41 9.29,29.45 U1.1
  Bottom 0.203: v12.03,32.55 11.27,31.63 10.66,31.02 9.85,31.02 v9.72,30.85
AMPIN3M  (via drill 0.2)
  Top 0.203: RN7.6 RN6.3 6.09,27.98 6.09,27.52 6.24,27.37 7.31,27.37 7.71,27.77 v8.58,27.77 | U1.8 11.56,27.68 v10.96,28.13
  Bottom 0.203: v8.58,27.77 10.61,27.77 v10.96,28.13
AMPIN3P  (via drill 0.2)
  Top 0.203: RN1.4 v14.33,30.5 CN1.5 | v12.6,26.81 12.6,27.61 U1.9
  Bottom 0.203: v14.33,30.5 14.32,30.49 14.32,28.74 13.55,27.98 13.55,27.88 v12.6,26.81
AMPIN4P  (via drill 0.2)
  Top 0.203: RN1.3 v15.51,30.57 15.51,30.74 15.23,31.02 15.23,31.51 CN1.6 | U1.12 12.25,30.17 12.34,30.26 13,30.26 14.01,29.15 | 14.01,29.15 14.06,29.04 14.37,28.74 v14.37,28.1 | 14.06,29.05 14.01,29.15
  Bottom 0.203: v15.51,30.57 15.54,30.39 15.54,28.89 14.93,28.28 14.55,28.28 v14.37,28.1
AUD1  (via drill 0.2)
  Top 0.203: U3.C10 v13.4,14.6 | RN1.8 16.64,27.71 v15.69,26.76
  Bottom 0.203: v13.4,14.6 13,14.6 12.8,14.8 12.8,15.63 13.05,15.88 13.05,19.8 12.89,19.9 12.89,21.17 11.88,22.19 11.57,22.19 11.27,22.49 11.27,23.56 14.01,26.3 14.16,26.3 14.47,26.6 v15.69,26.76
AUD3  (via drill 0.2)
  Top 0.203: U3.C9 v11.8,13.8 | v11.73,25.69 12.49,25.69 13.71,27.52 14.77,27.52 15.14,27.89 RN1.5
  Bottom 0.203: v11.8,13.8 11.8,14 12,14.2 12,16.06 12.23,16.29 12.23,19.24 12.03,19.44 12.03,20.81 11.42,21.42 10.96,21.42 10.36,22.03 10.36,23.86 v11.73,25.69
AUD4  (via drill 0.2)
  Top 0.203: U3.D9 v12.6,13.8 | v14.01,26.91 14.93,27.06 15.64,27.62 RN1.6
  Bottom 0.203: v12.6,13.8 12.6,14 12.4,14.2 12.4,15.85 12.64,16.09 12.64,19.44 12.49,19.59 12.49,20.97 11.73,21.78 11.27,21.78 10.81,22.19 10.81,23.71 v14.01,26.91
AUDF1  (via drill 0.2)
  Top 0.203: RN6.8 7.25,26.91 v7.76,26.91 | v10.2,28.28 10.36,28.43 10.36,28.74 10.2,28.89 10.2,29.2 10.56,29.56 U1.15 10.56,31.08 10.96,31.48 11.73,31.48 12.34,30.87 v12.95,30.87
  Bottom 0.203: v7.76,26.91 8.07,27.22 8.07,28.13 8.22,28.28 v10.2,28.28 | v12.95,30.87 14.93,32.85 18.18,32.85 SIDMAX.27
AUDF2
  Top 0.203: 10.51,27.12 U1.6
  Top 0.254: 10.51,27.12 10.12,27.12 U1.5
AUDF3
  Top 0.203: C10.2 17.21,34.33 17.62,33.92 18.71,33.92 19.19,33.46 19.19,31.18 19.8,30.57 19.8,29.82 AUD.1
AUDF4
  Top 0.203: AUD.2 20.26,31.9 20.26,33.01 18.76,34.38 17.82,34.38 16.48,35.72 C9.2
CONF_DONE  (via drill 0.2)
  Top 0.152: U3.C5 v8.6,14.6 | v3.19,16.24 1.76,16.24 R2.2
  Bottom 0.152: v3.19,16.24 3.5,16.24 4.2,15.54 4.2,14.8 4.6,14.4 7.2,14.4 7.6,14 8,14 v8.6,14.6
FAKE_CLK
  Top 0.152: U3.H8 U3.G9
GND  (via drill 0.2, 0.5, 0.6)
  Top 0.203: U1.4 9.29,27.77 v9.29,27.16
  Top 0.254: U2.55 U2.56 4.77,24.37 v4.56,24.32 | 6.5,0.99 C1.2 | 11.78,2.91 REG2.5 | 4.79,2.27 C2.2 | 1.34,9.71 v1.36,9.74 1.41,9.69 | U3.N13 v15.8,5.8 | v14.2,12.2 U3.E11 v13.4,13 | U3.F3 v7,12.2 | U3.A1 v5.55,16.62 | U3.B8 v11,14.6 | U3.A13 v15.8,15.4 | U3.G7 v11,10.6 | U3.J4 v7.8,9.8 | U3.M6 v10.2,6.6 | 1.42,26.45 C7.2 | v7.76,31.18 7.22,31.18 RN7.1 RN7.2 RN7.3 RN7.4 5.16,31.01 v5.02,30.87 | C8.2 12.95,35.75 13.86,36.46 19.15,36.46 R7.2 | U2.49 8.21,23.11 v8.22,23.05 | U2.8 8.21,19.91 8.07,20.05 v8.07,20.2 | U1.11 12.76,28.86 v13.2,29.09 | U3.L9 v11.8,7.4 | U2.38 12.61,23.43 12.64,23.25 v12.79,22.64 | v5.4,6.6 U3.N1 v6.2,5.8 | 4.02,26.51 v4.11,26.6 | v8.2,3.2 7.7,3.2 REG1.1 | U3.D5 v9.4,13 | v14.2,10.6 U3.H12 v15,9.8 | U3.C3 v7,13.8 | U2.19 12.61,17.32 v11.69,16.85
  Top 0.356: JTAG.5 10.81,33.31 11.36,33.86 C8.2 13.58,33.86 CN1.4 CN1.3 CN1.2 CN1.1 | REG2.5 13.21,2.65 C3.2 C4.2 15.23,2.16 15.23,1.31 15.63,0.91 v17.46,0.91 19.26,0.91 R10.1 | REG2.2 11.78,2.91 | 6.5,0.99 5.82,0.99 C2.2 | REG1.4 4.79,2.27 | C6.2 1.34,9.71 | R4.2 C7.2 4.02,26.51 | C5.2 1.41,9.69
  Top 0.508: C2.2 3.37,2.14 SIDMAX.14
  Bottom 0.254: v17.46,0.91 14.16,1 | v1.36,9.74 1.36,9.99 | v15.8,5.8 U3.N13 | U3.F3 v7,12.2 7,11.4 7.8,10.6 v7.8,9.8 U3.J4 | v5.55,16.62 U3.A1 | v11,14.6 U3.B8 | U3.A13 v15.8,15.4 15,14.6 | v11,10.6 U3.G7 | v10.2,6.6 U3.M6 | v7.76,31.18 7.46,31.02 | v12.79,22.64 12.64,23.41 | v8.22,23.05 8.22,23.25 | v4.56,24.32 4.56,24.17 | v8.07,20.2 8.07,20.81 | v11.8,7.4 11.4,7 | v5.4,6.6 5.4,7 | v4.11,26.6 4.26,26.6 | SIDMAX.14 7.27,2.48 v8.2,3.2 | v9.4,13 U3.D5
  pour Bottom (isolate 0.178): 0,0 4,0 4,4.2 10.4,4.2 10.4,0 21.8,0 21.8,37 0,37
LIN0  (via drill 0.2)
  Top 0.152: U3.B1 v6.2,15.4 | U2.2 5.8,18.64 5.8,20.05 v5.95,20.2
  Bottom 0.152: v5.95,20.2 6.2,19.8 v6.2,15.4
LIN1
  Top 0.152: U3.A2 6.6,16.03 6.24,16.39 6.24,18.6 U2.3
LIN2  (via drill 0.2)
  Top 0.152: U3.B2 v7,15.4 | v6.6,20.2 6.6,18.64 U2.4
  Bottom 0.152: v7,15.4 7,19.8 v6.6,20.2
LIN3
  Top 0.152: U3.A3 7.4,16 7,16.39 U2.5
LIN4  (via drill 0.2)
  Top 0.152: U3.B3 v7.8,15.4 | v7.4,20.2 7.4,18.64 U2.6
  Bottom 0.152: v7.8,15.4 7.8,19.8 v7.4,20.2
LIN5
  Top 0.152: U2.7 7.8,18.62 7.8,16.2 U3.A4
LIN6  (via drill 0.2)
  Top 0.152: U3.B4 v8.6,15.4 | U2.9 8.6,18.64 8.6,20.05 v8.75,20.2
  Bottom 0.152: v8.6,15.4 8.6,20.05 v8.75,20.2
LIN7
  Top 0.152: U3.A5 9,18.62 U2.10
LIN8  (via drill 0.2)
  Top 0.152: U3.B5 v9.4,15.4 | v9.4,20.2 9.4,18.64 U2.11
  Bottom 0.152: v9.4,15.4 v9.4,20.2
LIN9
  Top 0.152: U3.A6 9.8,18.62 U2.12
LIN10  (via drill 0.2)
  Top 0.152: U3.B6 v10.2,15.4 | U2.13 10.2,18.64 10.2,20.05 v10.05,20.2
  Bottom 0.152: v10.2,15.4 v10.05,20.2
LIN11
  Top 0.152: 10.6,18.62 U2.14 10.61,17.72 10.2,17.31 10.2,16.2 U3.A7
LIN12  (via drill 0.2)
  Top 0.152: U3.B7 v11,15.4 | U2.15 11,18.64 11,19.9 v10.7,20.2
  Bottom 0.152: v11,15.4 v10.7,20.2
LIN13
  Top 0.152: U2.16 11.41,17.76 10.66,17 10.66,16.55 U3.A8
LIN14
  Top 0.152: 12.2,18.62 U2.18 12.21,17.64 12.03,17.46 11.57,17.46 11.12,17 11.12,16.7 11.57,16.24 11.73,16.24 12.17,15.8 U3.A9
LIN15
  Top 0.152: U2.20 13,18.62 13,17.4 13.1,17.3 13.1,16.55 13,16.45 U3.A10
LIN16  (via drill 0.2)
  Top 0.152: U3.B10 v13.4,15.4 | v13.4,20.2 13.4,18.64 U2.21
  Bottom 0.152: v13.4,15.4 v13.4,20.2
LIN17
  Top 0.152: 13.8,18.62 U2.22 13.81,17.72 13.4,17.31 13.4,16.24 13.8,15.84 U3.A11
LIN18  (via drill 0.2)
  Top 0.152: U3.B11 v14.2,15.4 | v14.2,20.2 14.2,18.64 U2.23
  Bottom 0.152: v14.2,15.4 14.2,16.21 13.71,16.7 13.71,17.31 13.86,17.46 14.01,17.61 14.16,17.77 14.16,20.16 v14.2,20.2
LIN19
  Top 0.152: 14.6,18.62 U2.24 14.62,18.62 14.62,17.61 14.47,17.46 14.01,17.46 13.71,17.16 13.71,16.7 U3.A12
LIN20  (via drill 0.2)
  Top 0.152: U3.B12 v15,15.4 | v15,20.2 15,18.64 U2.25
  Bottom 0.152: v15,15.4 15,16.17 14.77,16.39 14.47,16.39 14.09,16.77 14.09,17.23 14.32,17.46 14.77,17.46 14.93,17.61 14.93,20.13 v15,20.2
LIN21  (via drill 0.2)
  Top 0.152: U3.K6 10.2,8.2 U3.K7 v11,9 | 15.38,18.6 U2.26 15.41,17.64 15.23,17.46 15.08,17.46 v14.62,17
  Bottom 0.152: v11,9 11.8,9 12.6,8.2 13.6,9.2 15.2,9.2 16.45,10.45 16.45,16.09 16.3,16.24 15.38,16.24 v14.62,17
LIN22  (via drill 0.2)
  Top 0.152: U3.L10 v13.4,8.2 | v20.26,5.66 20.99,4.93 R9.1 R10.2 | U2.27 15.81,19.78 v15.64,20.05 | v20.2,7.2 18.6,8.5 17.7,8.5 17.45,8.75 v17.37,9.13
  Bottom 0.152: v20.26,5.66 20.26,6.74 v20.2,7.2 | v13.4,8.2 14,7.6 14.4,7.6 15.27,8.47 15.84,8.87 16.93,9.6 | v15.64,20.05 15.84,19.75 15.84,17.92 16.3,17.46 16.3,17.31 17.06,16.55 17.06,9.69 16.93,9.6 | v17.37,9.13 17.28,9.25 16.93,9.6
LIN23  (via drill 0.2)
  Top 0.152: U3.L11 v14.2,8.2 | U2.28 16.21,17.32 v15.89,17
  Top 0.203: U3.M12 U3.L11
  Bottom 0.152: v15.89,17 16.15,17 16.76,16.39 16.76,9.99 15.37,8.92 14.77,8.77 v14.2,8.2
LVLA0
  Top 0.152: SIDMAX.6 3.04,23.86 4.72,25.54 5.94,25.54 6.21,25.26 U2.54
LVLA1
  Top 0.152: SIDMAX.5 3.6,25.34 4.11,25.84 6.09,25.84 6.61,25.32 U2.53
LVLA2
  Top 0.152: U2.52 7,23.25 6.85,23.1 5.33,23.1 3.34,21.12 2.66,21.12 2.2,20.66 2.2,19.75 2.68,19.34 3.22,19.34 3.52,18.98 3.5,18.38 3.04,17.92 SIDMAX.8
LVLA3
  Top 0.152: SIDMAX.7 3.04,20.36 5.48,22.8 7.31,22.8 7.46,22.95 7.46,24.32 U2.51
LVLA4
  Top 0.152: SIDMAX.9 3.19,15.18 3.85,15.79 3.85,20.2 4.26,20.66 4.26,21.12 5.63,22.49 7.46,22.49 7.76,22.8 7.76,23.25 7.81,23.3 U2.50
LVLA5
  Top 0.152: SIDMAX.10 3.24,12.64 4.16,13.5 4.16,20.05 4.56,20.51 4.56,20.97 5.78,22.19 8.53,22.19 8.68,22.34 8.68,23.25 8.61,23.32 U2.48
LVLA6
  Top 0.152: U2.47 9.01,22.06 8.83,21.88 5.94,21.88 4.87,20.81 4.87,20.36 4.46,19.9 4.46,11.06 3.45,10.09 SIDMAX.11
LVLA7
  Top 0.152: SIDMAX.12 4.41,7.55 5.02,8.16 5.02,9.38 4.77,9.64 4.77,19.75 5.17,20.2 5.17,20.66 6.09,21.58 8.98,21.58 9.41,22.01 U2.46
LVLA8
  Top 0.152: U2.45 9.81,21.95 9.14,21.27 6.24,21.27 5.48,20.51 5.48,20.05 5.07,19.59 5.07,9.94 5.33,9.69 5.33,7.3 SIDMAX.13
LVLA9
  Top 0.152: SIDMAX.15 18.28,3.75 17.21,4.81 17.21,5.12 16.3,6.03 16.3,16.39 16.6,16.7 16.6,19.29 16.53,19.59 16.3,19.98 16.08,20.28 15.59,20.66 12.03,20.66 11.42,21.27 10.51,21.27 10.2,21.58 U2.44
LVLA10
  Top 0.152: SIDMAX.16 17.77,5.02 16.6,6.18 16.6,16.24 17.06,16.7 17.06,19.14 16.88,19.62 16.68,20 16.43,20.42 15.94,20.97 12.18,20.97 11.57,21.58 10.96,21.58 10.61,21.93 U2.43
LVLA11
  Top 0.152: SIDMAX.17 18.13,7.55 16.91,8.77 16.91,15.94 17.36,16.39 17.36,19.39 16.91,20.26 16.44,20.95 16.11,21.27 12.34,21.27 11.73,21.88 11.27,21.88 11.01,22.14 U2.42
LVLA12
  Top 0.152: SIDMAX.18 18.28,10.45 17.21,11.52 17.21,15.63 17.44,15.86 17.75,15.86 19.19,17.31 19.19,18.17 17.67,19.47 17.09,20.61 16.59,21.25 16.27,21.58 12.49,21.58 11.88,22.19 11.57,22.19 11.37,22.35 U2.41
LVLA13  (via drill 0.2)
  Top 0.152: U2.40 11.81,22.86 v11.85,22.72
  Bottom 0.152: SIDMAX.19 17.62,12.64 17.36,12.89 17.36,16.7 16.6,17.46 16.6,19.75 15.23,21.12 13.55,21.12 v11.85,22.72
LVLA14
  Top 0.152: SIDMAX.22 18.08,20.26 16.45,21.88 12.79,21.88 12.34,22.34 12.34,22.95 12.18,23.1 12.18,24.34 U2.39
LVLA15  (via drill 0.2)
  Top 0.152: U2.37 13.04,23.19 14.01,22.19 16.6,22.19 17.52,21.27 18.58,21.27 19.19,20.66 19.19,19.75 v18.89,19.44
  Bottom 0.152: v18.89,19.44 18.89,18.33 SIDMAX.21
LVLA16
  Top 0.152: U2.36 13.4,23.25 14.16,22.49 16.76,22.49 17.67,21.58 18.74,21.58 19.5,20.81 19.5,19.59 19.35,19.44 19.35,18.53 19.65,18.22 19.65,17.31 18.58,16.24 18.58,15.48 SIDMAX.20
LVLA17
  Top 0.152: JP4.1 19.17,21.6 18.89,21.88 17.82,21.88 16.91,22.8 14.32,22.8 13.81,23.3 U2.35
LVLA18  (via drill 0.2)
  Top 0.152: U2.34 14.21,25.64 v14.16,25.69
  Bottom 0.152: JP4.2 20.38,24.17 18.13,24.17 16.15,26.15 15.69,26.15 15.54,26.3 14.77,26.3 v14.16,25.69
LVLA19  (via drill 0.2)
  Top 0.152: 14.62,24.38 14.62,25.74 15.08,26.2 15.89,26.2 v16.45,26.76
  Top 0.203: 14.62,24.38 U2.33
  Bottom 0.152: JP4.3 19.88,26.68 19.5,26.3 16.91,26.3 v16.45,26.76
LVLA20  (via drill 0.2)
  Top 0.152: U2.32 15.01,25.47 v15.23,25.69
  Bottom 0.152: v15.23,25.69 16.15,25.69 17.98,23.86 18.89,23.86 19.35,23.41 19.35,20.12 H1.1
LVLA21
  Top 0.152: SIDMAX.23 17.36,22.8 17.06,23.1 15.69,23.1 15.41,23.38 U2.31
LVLA22  (via drill 0.2)
  Top 0.203: U2.30 15.81,25.36 17.36,26.91 v17.36,27.06
  Bottom 0.203: SIDMAX.26 18.28,29.35 17.21,28.28 17.21,27.22 v17.36,27.06
LVLA23
  Top 0.152: U2.29 17.31,24.37 SIDMAX.24
N$5  (via drill 0.2)
  Top 0.203: U1.14 11.12,30.09 11.12,30.72 v11.42,30.97 | RN6.5 5.55,26.99 v5.17,27.37 | C9.1 14.06,35.7 v14.01,35.75
  Bottom 0.203: v5.17,27.37 7.15,27.37 7.61,27.82 7.61,28.28 8.07,28.74 9.14,28.74 9.29,28.89 10.36,28.89 10.66,28.64 11.27,28.64 11.57,28.89 11.57,29.35 11.42,29.5 v11.42,30.97 | 11.12,30.72 v11.42,30.97 | v11.42,30.97 11.73,31.02 13.4,32.7 13.4,35.14 v14.01,35.75
N$7  (via drill 0.2)
  Top 0.203: U1.7 11.12,27.12 11.12,26 10.81,25.69 v10.2,25.69 6.75,25.69 6.09,26.33 RN6.6 | v14.01,34.38 15.09,34.38 C10.1
  Bottom 0.203: v14.01,34.38 13.86,34.23 13.86,32.55 12.18,30.87 12.18,30.26 12.64,29.81 13.55,29.81 13.86,29.5 13.9,28.89 10.8,25.69 v10.2,25.69
N$22  (via drill 0.2)
  Top 0.203: RN6.4 5.55,28.05 | RN7.5 5.53,29.71 | U1.13 11.56,29.64 11.12,29.2 v10.91,29.2
  Top 0.254: 5.55,28.05 5.55,28.86 v5.53,28.89 5.55,28.92 RN7.5
  Bottom 0.203: 6.85,29.5 8.22,30.87 8.98,30.87 9.29,30.57 9.29,29.96 9.9,29.35 10.51,29.35 10.66,29.2 v10.91,29.2
  Bottom 0.254: 6.85,29.5 6.85,29.2 6.54,28.89 v5.53,28.89
N$137
  Top 0.254: L1.1 8.78,3.8 | REG1.2
  Top 0.34: 7,3.75 REG1.2
  Top 0.356: 8.78,3.8 8.37,4.2 7.46,4.2 7,3.75
NSTATUS  (via drill 0.2)
  Top 0.152: U3.C4 v7.8,14.6 | R3.1 2.12,18.08 2.12,17 v2.61,16.7
  Bottom 0.152: 2.58,16.7 v2.61,16.7 3.5,16.7 4.6,15.6 4.6,15 4.8,14.8 7.6,14.8 v7.8,14.6
RAW1  (via drill 0.2)
  Top 0.152: U3.N12 v15,6.6 | v17.1,7.4 17.8,6.6 20.6,6.6 20.8,6.8 20.8,8.5 JP1.1
  Bottom 0.152: v15,6.6 16.1,6.6 v17.1,7.4
RAW2  (via drill 0.2)
  Top 0.152: U3.L12 v15,7.4 | v18.8,9 20.4,10.6 JP1.2
  Bottom 0.152: v15,7.4 16,7.4 16.8,8.2 17.4,8.2 v18.8,9
RAW3  (via drill 0.2)
  Top 0.152: U3.L13 v15.8,8.2 | v19,11 19,11.8 20.4,13.2 JP1.3
  Bottom 0.152: v15.8,8.2 16.2,8.2 16.6,8.6 17.45,8.6 18,9 18,9.15 17.4,9.75 17.4,10.6 17.8,11 v19,11
TCK  (via drill 0.2)
  Top 0.152: U3.G2 v6.2,11.4 | R4.1 1.36,21.5 v1.44,21.42
  Bottom 0.152: v6.2,11.4 4.22,11.4 4.19,11.36 1.97,11.36 1.26,12.08 1.26,21.27 v1.44,21.42 1.41,21.45 1.41,28.03 2.28,28.89 2.28,29.5 1.67,30.11 1.67,32.85 3.19,34.38 7.23,34.38 JTAG.4
TDI  (via drill 0.2)
  Top 0.152: JTAG.3 6.85,34.38 1.78,34.38 R6.1 | v8.6,12.2 U3.F5
  Bottom 0.152: JTAG.3 7.94,32.55 7.15,32.55 6.54,31.94 2.73,31.94 2.12,31.33 2.12,30.11 2.58,29.65 2.58,28.74 1.82,27.98 1.82,21.88 1.97,21.73 1.97,21.27 1.57,20.87 1.57,12.23 2.12,11.67 3.47,11.67 4.6,12.8 7.4,12.8 8,12.2 v8.6,12.2
TDO  (via drill 0.2)
  Top 0.152: U3.F6 v9.4,12.2 | v4.56,31.33 5.02,31.79 7.76,31.79 7.92,31.63 8.68,31.63 9.47,32.4 9.44,34.3 JTAG.6
  Bottom 0.152: 4.26,31.02 v4.56,31.33 3.95,30.72 3.95,29.96 3.65,29.65 3.65,28.74 3.95,28.43 3.95,27.52 3.34,26.91 2.89,26.91 2.12,26.15 2.12,22.03 2.28,21.88 2.28,21.12 1.87,20.71 1.87,13.93 2.2,13.6 3.4,13.6 3.8,13.2 7.6,13.2 8,12.8 8.8,12.8 v9.4,12.2
TMS  (via drill 0.2)
  Top 0.152: 1.47,32.89 R5.1 1.36,33.46 1.82,33.92 v1.97,33.92 4.95,33.92 JTAG.1 | U3.G1 v6.2,10.6
  Bottom 0.152: v6.2,10.6 4,10.6 3.6,11 1.88,11 0.96,11.92 0.96,28.18 1.36,28.59 1.52,28.59 1.97,29.04 1.97,29.35 1.36,29.96 1.36,33.31 v1.97,33.92
VDD
  Top 0.254: R8.1 18.94,34.84 SIDMAX.28
VDD_REDUCED  (via drill 0.2)
  Top 0.152: U3.M7 v11,6.6 | v11,5.8 11.4,5.4 15,5.4 15.13,5.27 v16.3,5.27 | v17.36,6.18 21.02,6.18 21.33,6.49 21.33,33.92 20.76,34.49 R8.2
  Top 0.254: R7.1 R8.2
  Bottom 0.152: v11,6.6 v11,5.8 | v16.3,5.27 v17.36,6.18